# EAGLE design Hormiga_877_FTDI_Rev_C (EAGLE 9.6.2)

## Sheet 1 of 2: Main Board
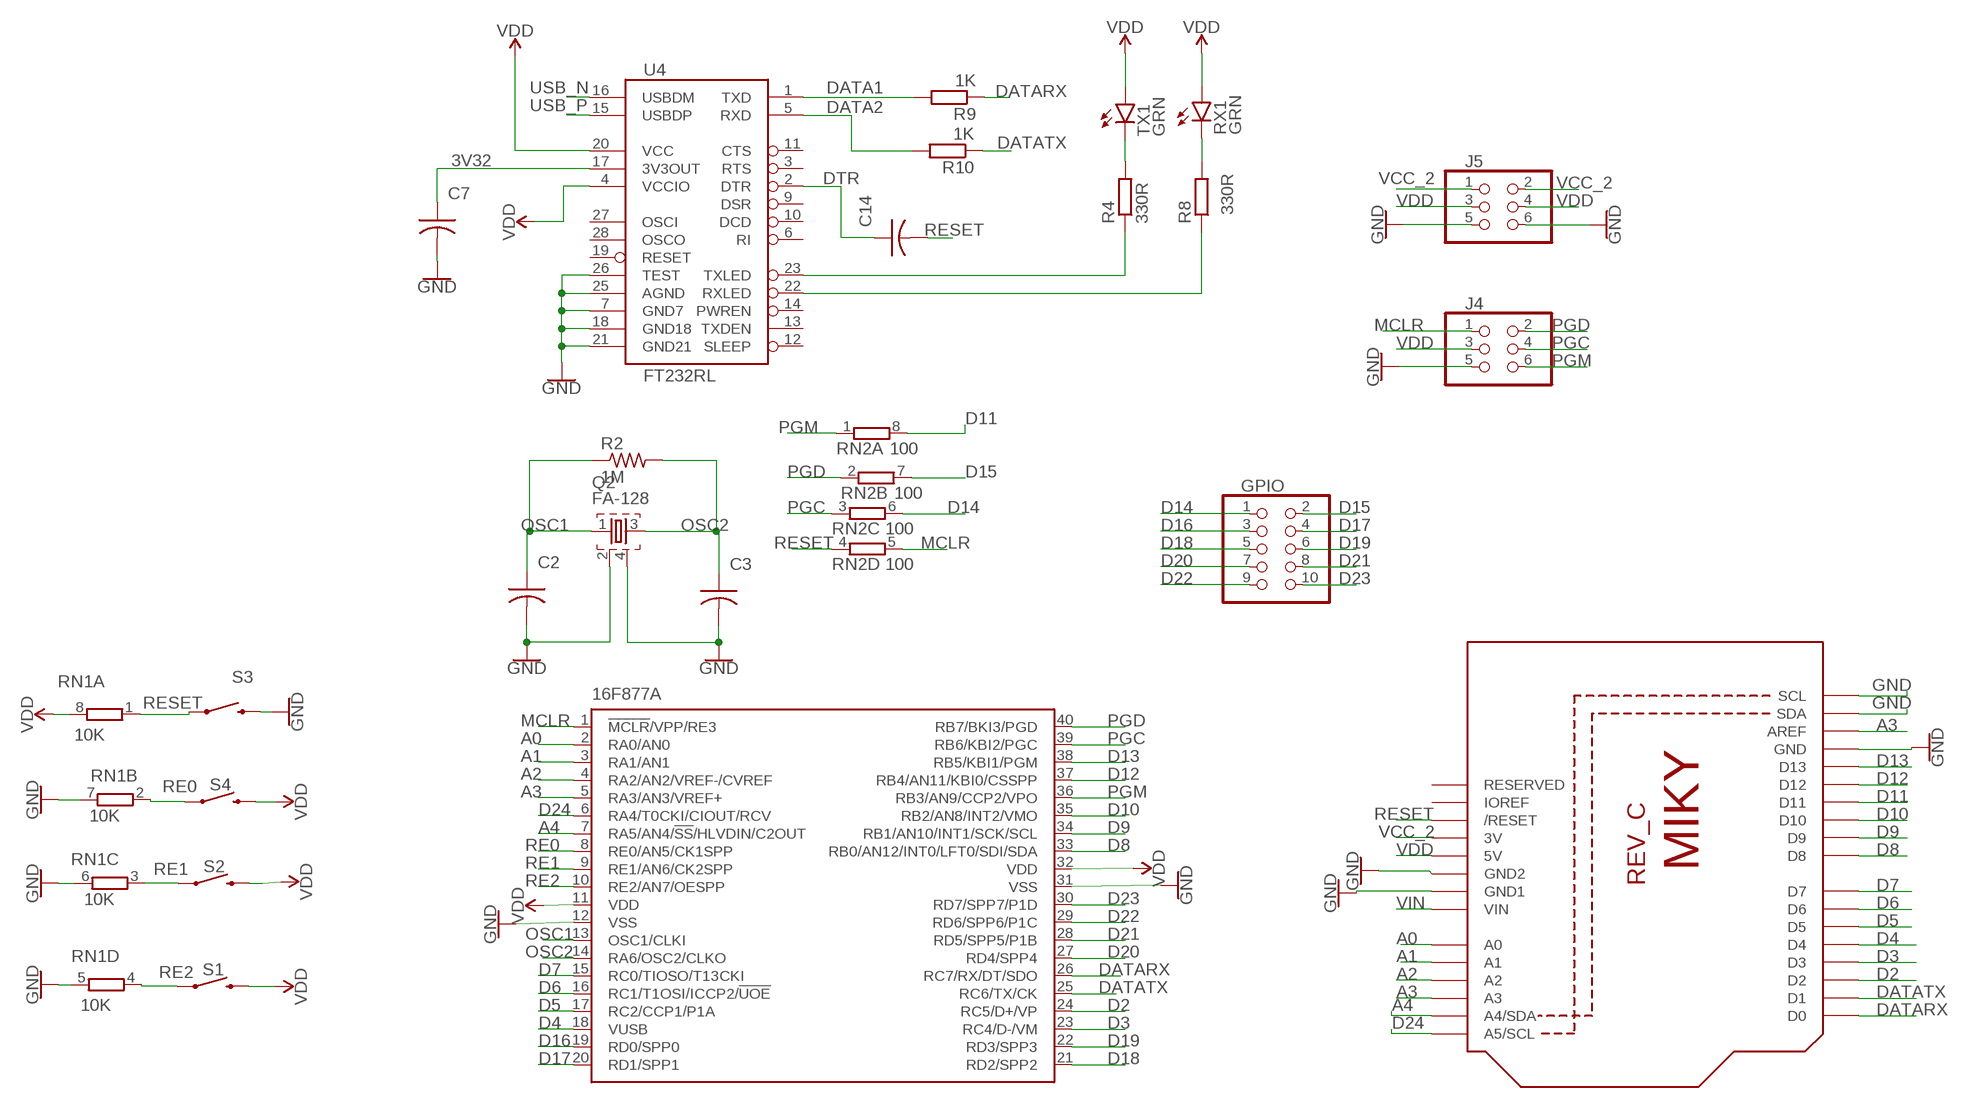
[diagram p0: schematic, sheet 1]

### Parts
16F877A  PIC18F4550_40  [DIL40]
C2  15pF  C-USC0603  [C0603]
C3  15pF  C-USC0603  [C0603]
C7  0.1uF  C-USC0603  [C0603]
C14  0.1uF  C-USC0603  [C0603]
GPIO  PINHD-2X5  [2X05]
J4  ICSP  PINHD-2X3  [2X03]
J5  POWER  PINHD-2X3  [2X03]
Q2  FA-128  [FA-128]
R2  1M  R-US_R0603  [R0603]
R4  330R  R-EU_R0805  [R0805]
R8  330R  R-EU_R0805  [R0805]
R9  1K  R-EU_R0805  [R0805]
R10  1K  R-EU_R0805  [R0805]
RN1  10K  4R-N0603-ARC  [0603-ARC]
RN2  100  4R-N0603-ARC  [0603-ARC]
RX1  GRN  LEDCHIP-LED0603  [CHIP-LED0603]
S1  MOMENTARY-SWITCH-SPST-SMD-5.2-REDUNDANT  [TACTILE_SWITCH_SMD_5.2MM]
S2  MOMENTARY-SWITCH-SPST-SMD-5.2-REDUNDANT  [TACTILE_SWITCH_SMD_5.2MM]
S3  MOMENTARY-SWITCH-SPST-SMD-5.2-REDUNDANT  [TACTILE_SWITCH_SMD_5.2MM]
S4  MOMENTARY-SWITCH-SPST-SMD-5.2-REDUNDANT  [TACTILE_SWITCH_SMD_5.2MM]
TX1  GRN  LEDCHIP-LED0603  [CHIP-LED0603]
U2  ARDUINOR3-DIMENSION  [ARDUINOR3]
U4  FT232RL  FT232RLSSOP  [SSOP28DB]

### Nets
3V32: C7.1 U4.17(3V3OUT)
A0 [SIGNALPIC]: 16F877A.2(RA0/AN0) U2.A0
A1: 16F877A.3(RA1/AN1) U2.A1
A2 [SIGNALPIC]: 16F877A.4(RA2/AN2/VREF-/CVREF) U2.A2
A3 [SIGNALPIC]: 16F877A.5(RA3/AN3/VREF+) U2.A3 U2.AREF
A4: 16F877A.7(RA5/AN4/!SS!/HLVDIN/C2OUT) U2.A4(A4/SDA)
D2 [SIGNALPIC]: 16F877A.24(RC5/D+/VP) U2.D2
D3 [SIGNALPIC]: 16F877A.23(RC4/D-/VM) U2.D3
D4 [SIGNALPIC]: 16F877A.18(VUSB) U2.D4
D5 [SIGNALPIC]: 16F877A.17(RC2/CCP1/P1A) U2.D5
D6 [SIGNALPIC]: 16F877A.16(RC1/T1OSI/ICCP2/!UOE) U2.D6
D7 [SIGNALPIC]: 16F877A.15(RC0/TIOSO/T13CKI) U2.D7
D8 [SIGNALPIC]: 16F877A.33(RB0/AN12/INT0/LFT0/SDI/SDA) U2.D8
D9 [SIGNALPIC]: 16F877A.34(RB1/AN10/INT1/SCK/SCL) U2.D9
D10 [SIGNALPIC]: 16F877A.35(RB2/AN8/INT2/VMO) U2.D10
D11 [SIGNALPIC]: RN2.8 U2.D11
D12 [SIGNALPIC]: 16F877A.37(RB4/AN11/KBI0/CSSPP) U2.D12
D13 [SIGNALPIC]: 16F877A.38(RB5/KBI1/PGM) U2.D13 ; also sheet 2
D14: GPIO.1 RN2.6
D15 [SIGNALPIC]: GPIO.2 RN2.7
D16 [SIGNALPIC]: 16F877A.19(RD0/SPP0) GPIO.3
D17 [SIGNALPIC]: 16F877A.20(RD1/SPP1) GPIO.4
D18 [SIGNALPIC]: 16F877A.21(RD2/SPP2) GPIO.5
D19 [SIGNALPIC]: 16F877A.22(RD3/SPP3) GPIO.6
D20 [SIGNALPIC]: 16F877A.27(RD4/SPP4) GPIO.7
D21 [SIGNALPIC]: 16F877A.28(RD5/SPP5/P1B) GPIO.8
D22 [SIGNALPIC]: 16F877A.29(RD6/SPP6/P1C) GPIO.9
D23: 16F877A.30(RD7/SPP7/P1D) GPIO.10
D24: 16F877A.6(RA4/T0CKI/CIOUT/RCV) U2.A5(A5/SCL)
DATA1: R9.2 U4.1(TXD)
DATA2: R10.2 U4.5(RXD)
DATARX [SIGNALPIC]: 16F877A.26(RC7/RX/DT/SDO) R9.1 U2.D0
DATATX [SIGNALPIC]: 16F877A.25(RC6/TX/CK) R10.1 U2.D1
DTR: C14.1 U4.2(DTR)
GND [SIGNALPIC]: 16F877A.12(VSS) 16F877A.31(VSS) C2.2 C3.2 C7.2 J4.5 J5.5 J5.6 Q2.2 Q2.4 RN1.5 RN1.6 RN1.7 S3.3 S3.4 U2.GND U2.GND1 U2.GND2 U2.SCL U2.SDA U4.7(GND7) U4.18(GND18) U4.21(GND21) U4.25(AGND) U4.26(TEST) ; also sheet 2
MCLR: 16F877A.1(!MCLR!/VPP/RE3) J4.1 RN2.5
OSC1 [SIGNAL3V3]: 16F877A.13(OSC1/CLKI) C2.1 Q2.1 R2.1
OSC2 [SIGNAL3V3]: 16F877A.14(RA6/OSC2/CLKO) C3.1 Q2.3 R2.2
PGC: 16F877A.39(RB6/KBI2/PGC) J4.4 RN2.3
PGD: 16F877A.40(RB7/BKI3/PGD) J4.2 RN2.2
PGM: 16F877A.36(RB3/AN9/CCP2/VPO) J4.6 RN2.1
RE0 [SIGNALPIC]: 16F877A.8(RE0/AN5/CK1SPP) RN1.2 S4.1 S4.2
RE1 [SIGNALPIC]: 16F877A.9(RE1/AN6/CK2SPP) RN1.3 S2.1 S2.2
RE2: 16F877A.10(RE2/AN7/OESPP) RN1.4 S1.1 S1.2
RESET [SIGNALPIC]: C14.2 RN1.1 RN2.4 S3.1 S3.2 U2.RESET(/RESET)
RX1: R8.2 RX1.C
RXLED [LEDUSART]: R8.1 U4.22(RXLED)
TX1: R4.2 TX1.C
TXLED [LEDUSART]: R4.1 U4.23(TXLED)
USB_N: U4.16(USBDM) ; also sheet 2
USB_P: U4.15(USBDP) ; also sheet 2
VCC_2 [SIGNAL3V3]: J5.1 J5.2 U2.3V ; also sheet 2
VDD: 16F877A.11(VDD) 16F877A.32(VDD) J4.3 J5.3 J5.4 RN1.8 RX1.A S1.3 S1.4 S2.3 S2.4 S4.3 S4.4 TX1.A U2.5V U4.4(VCCIO) U4.20(VCC) ; also sheet 2
VIN [SIGNALPIC]: U2.VIN ; also sheet 2
Unconnected: U2.IOREF U2.RESERVED U4.3(RTS) U4.6(RI) U4.9(DSR) U4.10(DCD) U4.11(CTS) U4.12(SLEEP) U4.13(TXDEN) U4.14(PWREN) U4.19(RESET) U4.27(OSCI) U4.28(OSCO)

## Sheet 2 of 2: Power_Supply
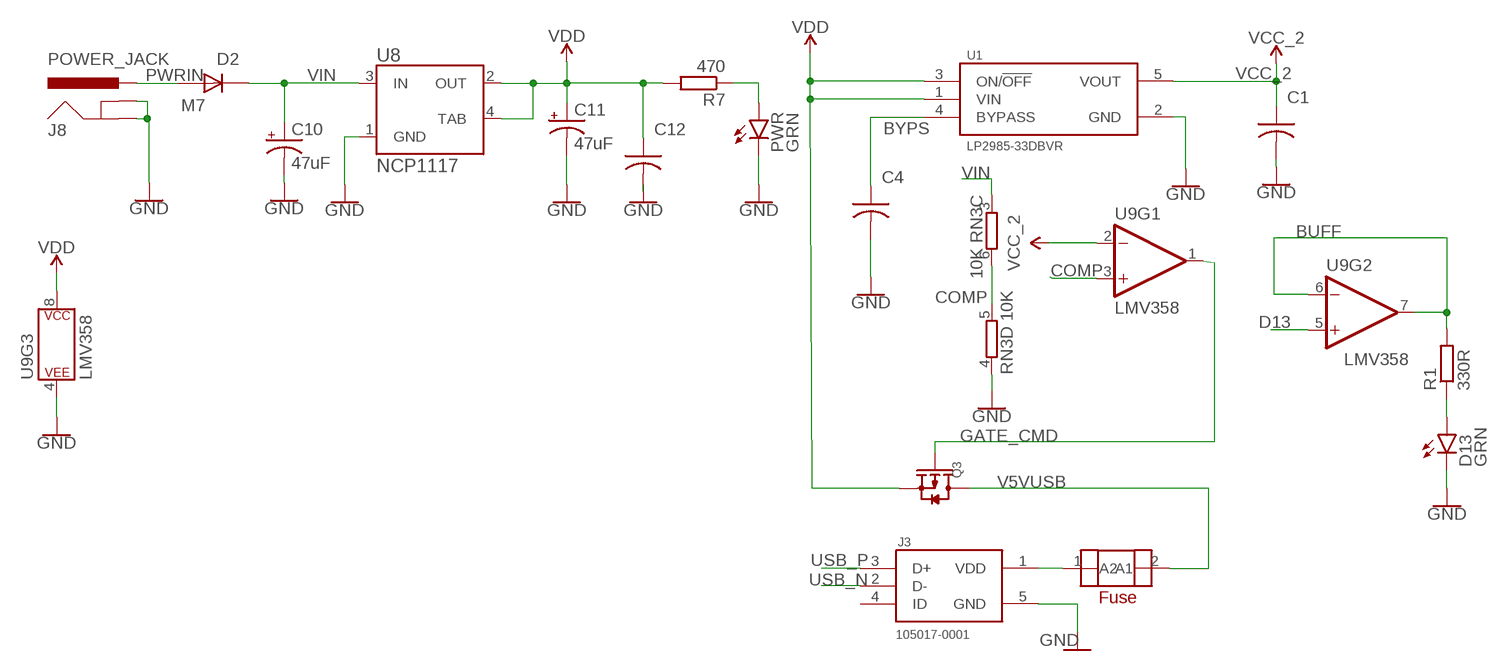
[diagram p1: schematic, sheet 2]

### Parts
C1  1.0uF  C-USC0603  [C0603]
C4  10nF  C-USC0603  [C0603]
C10  47uF  47UF-POLAR-PANASONIC_D-35V-20%  [PANASONIC_D]
C11  47uF  47UF-POLAR-PANASONIC_D-35V-20%  [PANASONIC_D]
C12  0.1uF  C-USC0603  [C0603]
D2  M7  [DIOM505270X240]
D13  GRN  LEDCHIP-LED0603  [CHIP-LED0603]
FUSE  FUSE0603  [R0603]
J3  105017-0001  [MOLEX_105017-0001]
J8  POWER_JACK  [POWER_JACK_PTH]
PWR  GRN  LEDCHIP-LED0603  [CHIP-LED0603]
Q3  SMD-MOSFET-P-CH-20V-2A(SOT-23)  [SOT-23]
R1  330R  R-EU_R0805  [R0805]
R7  470  R-EU_R0805  [R0805]
RN3  10K  4R-N0603-ARC  [0603-ARC]
U1  LP2985-33DBVR  [SOT95P280X145-5N]
U8  NCP1117  [SOT223]
U9  LMV358  LMV358SOIC  [SO08]

### Nets
BUFF [SIGNALPIC]: R1.2 U9.6(-IN) U9.7(OUT)
BYPS: C4.1 U1.4(BYPASS)
COMP: RN3.5 RN3.6 U9.3(+IN)
D13 [SIGNALPIC]: U9.5(+IN) ; also sheet 1
D13LED [SIGNALPIC]: D13.A R1.1
GATE_CMD [SIGNAL]: Q3.1(G) U9.1(OUT)
GND [SIGNALPIC]: C1.2 C4.2 C10.- C11.- C12.2 D13.C J3.5(GND) J8.GND J8.GNDBREAK PWR.C RN3.4 U1.2(GND) U8.1(GND) U9.4(P$V-) ; also sheet 1
PWRIN [SIGNALPIC]: D2.A J8.PWR
PWRLED [SIGNALPIC]: PWR.A R7.1
USB_N: J3.2(D-) ; also sheet 1
USB_P: J3.3(D+) ; also sheet 1
V5VUSB: FUSE.2(A2) Q3.3(D)
VCC_2 [SIGNAL3V3]: C1.1 U1.5(VOUT) U9.2(-IN) ; also sheet 1
VDD: C11.+ C12.1 Q3.2(S) R7.2 U1.1(VIN) U1.3(ON/!OFF) U8.2(OUT) U8.4(TAB) U9.8(P$V+) ; also sheet 1
VDD5: FUSE.1(A1) J3.1(VDD)
VIN [SIGNALPIC]: C10.+ D2.C RN3.3 U8.3(IN) ; also sheet 1
Unconnected: J3.4(ID) RN3.1 RN3.2 RN3.7 RN3.8

## Library data of the parts
16F877A = microchip:PIC18F4*_40: USB Microcontrollers with nanoWatt Technology High-Performance, Enhanced Flash, 28/40/44-Pin, Source: http://ww1.microchip.com/downloads/en/devicedoc/39632c.pdf; MF: MICROCHIP; MPN: PIC18F4550-I/P; OC_FARNELL: 9321357; OC_NEWARK: 74K8623
C1 = rcl:C-US: CAPACITOR, American symbol; MPN: C1608X5R1E105K080AC; OC_NEWARK: 90R7677; SPICEPREFIX: C
C2 C3 = rcl:C-US: CAPACITOR, American symbol; MF: FARNELL; MPN: CC0402JRNPO9BN150; OC_NEWARK: 69C9582; SPICEPREFIX: C
C4 = rcl:C-US: CAPACITOR, American symbol; MPN: C0603C103K1RACTU; OC_NEWARK: 29T8974; SPICEPREFIX: C
C7 C12 C14 = rcl:C-US: CAPACITOR, American symbol; MPN: C0603C103J1RACTU; OC_NEWARK: 07X0751; SPICEPREFIX: C
C10 C11 = SparkFun-Capacitors:47UF-POLAR: 47µF polarized capacitors A capacitor is a passive two-terminal electrical component used to store electrical energy temporarily in an electric field.; MPN: EEE-1CA470WR; OC_NEWARK: 53W3779; PROD_ID: CAP-08478
D2 = Tonche_Library:M7: none; AVAILABILITY: Unavailable; MP: M7; MPN: RFN1LAM7STFTR; OC_NEWARK: 58AC3694; PACKAGE: DO-214 Diodes Inc.; PRICE: 0.01 USD
D13 PWR RX1 TX1 = led:LED: LED OSRAM: - CHIPLED LG R971, LG N971, LY N971, LG Q971, LY Q971, LO R971, LY R971 LH N974, LH R974 LS Q976, LO Q976, LY Q976 LO Q996 - Hyper CHIPLED LW Q18S LB Q993, LB Q99A, LB R99A - SideLED LS A670, LO A670, LY A670, LG A670, LP A670 LB A673, LV A673, LT A673, LW A673 LH A674 LY A675 LS A676, LA A676, LO A676, LY A676, LW A676 LS A679, LY A679, LG A679 - Hyper Micro SIDELED® LS Y876, LA Y876, LO Y876, LY Y876 LT Y87S - SmartLED LW L88C, LW L88S LB L89C, LB L89S, LG L890 LS L89K, LO L89K, LY L89K LS L896, LA L896, LO L896, LY L896 - TOPLED LS T670, LO T670, LY T670, LG T670, LP T670 LSG T670, LSP T670, LSY T670, LOP T670, LYG T670 LG T671, LOG T671, LSG T671 LB T673, LV T673, LT T673, LW T673 LH T674 LS T676, LA T676, LO T676, LY T676, LB T676, LH T676, LSB T676, LW T676 LB T67C, LV T67C, LT T67C, LS T67K, LO T67K, LY T67K, LW E67C LS E67B, LA E67B, LO E67B, LY E67B, LB E67C, LV E67C, LT E67C LW T67C LS T679, LY T679, LG T679 LS T770, LO T770, LY T770, LG T770, LP T770 LB T773, LV T773, LT T773, LW T773 LH T774 LS E675, LA E675, LY E675, LS T675 LS T776, LA T776, LO T776, LY T776, LB T776 LHGB T686 LT T68C, LB T68C - Hyper Mini TOPLED® LB M676 - Mini TOPLED Santana® LG M470 LS M47K, LO M47K, LY M47K Source: http://www.osram.convergy.de LUXEON: - LUMILED® LXK2-PW12-R00, LXK2-PW12-S00, LXK2-PW14-U00, LXK2-PW14-V00 LXK2-PM12-R00, LXK2-PM12-S00, LXK2-PM14-U00 LXK2-PE12-Q00, LXK2-PE12-R00, LXK2-PE12-S00, LXK2-PE14-T00, LXK2-PE14-U00 LXK2-PB12-K00, LXK2-PB12-L00, LXK2-PB12-M00, LXK2-PB14-N00, LXK2-PB14-P00, LXK2-PB14-Q00 LXK2-PR12-L00, LXK2-PR12-M00, LXK2-PR14-Q00, LXK2-PR14-R00 LXK2-PD12-Q00, LXK2-PD12-R00, LXK2-PD12-S00 LXK2-PH12-R00, LXK2-PH12-S00 LXK2-PL12-P00, LXK2-PL12-Q00, LXK2-PL12-R00 Source: www.luxeon.com KINGBRIGHT: KA-3528ASYC Source: www.kingbright.com; MPN: HSME-C191; OC_NEWARK: 05M0345
FUSE = Tonche_Library:FUSE0603
GPIO = pinhead:PINHD-2X5: PIN HEADER
J3 = MICRO-B_MOLEX_105017-0001:105017-0001; AVAILABILITY: Unavailable; DESCRIPTION: Conn USB Type B M 5 POS 0.65mm Solder RA Thru-Hole 5 Terminal 1 Port Embossed T/R; MF: Molex; MP: 105017-0001; PACKAGE: None; PRICE: None
J4 J5 = pinhead:PINHD-2X3: PIN HEADER
J8 = SparkFun-Connectors:POWER_JACK: Power Jack Connector This is the standard 5.5mm barrel jack for power. The PTH is the most common, proven, reliable, footprint. The Slot footprint only works if the mill layer is transmitted to the PCB fab house so be warned. Here are the connectors we sell at SparkFun: DC Barrel Power Jack/Connector <https://www.sparkfun.com/products/119> (PRT-00119) DC Barrel Power Jack/Connector (SMD) <https://www.sparkfun.com/products/12748> (PRT-12748) DC Barrel Jack Adapter - Breadboard Compatible <https://www.sparkfun.com/products/10811> (PRT-10811) It is used on this SparkFun product (and many, many others): SparkFun RedBoard - Programmed with Arduino <https://www.sparkfun.com/products/12757> (DEV-12757) Also, if you need a mating power supply or connector, please check these out: Wall Adapter Power Supply - 9VDC 650mA <https://www.sparkfun.com/products/298> (TOL-00298) DC Barrel Jack Adapter - Male <https://www.sparkfun.com/products/10287> (PRT-10287); MPN: FC681465P; OC_NEWARK: 20T2054; PROD_ID: CONN-08197
Q2 = crystal:FA-: MHz RANGE CRYSTAL UNIT Source: Epson Toyocom
Q3 = SMD-MOSFET-P-CH-20V-2A_SOT-23_:SMD-MOSFET-P-CH-20V-2A(SOT-23): 305030026; AVAILABILITY: Good; DESCRIPTION: Single P-Channel 20V 70 mOhm Logic Level PowerTrench Mosfet SSOT-3; MF: FAIRCHILD SEMICONDUCTOR; MP: FDN340P; MPN: FDN340P; OC_NEWARK: 58K8841; PACKAGE: SC-59 ON Semiconductor; PRICE: 0.19 USD
R1 R4 R8 = rcl:R-EU_: RESISTOR, European symbol; MPN: ERJ-6GEYJ331V; OC_NEWARK: 65T8817; SPICEPREFIX: R
R2 = rcl:R-US_: RESISTOR, American symbol; SPICEPREFIX: R
R7 = rcl:R-EU_: RESISTOR, European symbol; MPN: ERJ-6GEYJ471V; OC_NEWARK: 65T8826; SPICEPREFIX: R
R9 R10 = rcl:R-EU_: RESISTOR, European symbol; MPN: EXB-V8V103JV; OC_NEWARK: 65T8998; SPICEPREFIX: R
RN1 RN3 = resistor-dil:4R-N: Array Chip Resistor Source: RS Component / Phycomp; MPN: EXB-V8V103JV; OC_FARNELL: unknown; OC_NEWARK: 65T8998
RN2 = resistor-dil:4R-N: Array Chip Resistor Source: RS Component / Phycomp; OC_FARNELL: unknown; OC_NEWARK: unknown
S1-S4 = SparkFun-Switches:MOMENTARY-SWITCH-SPST: Momentary Switch (Pushbutton) - SPST Normally-open (NO) SPST momentary switches (buttons, pushbuttons). Variants PTH-12MM - 12mm square, through-hole Momentary Pushbutton Switch - 12mm Square <https://www.sparkfun.com/products/9190> (COM-09190) PTH-6.0MM, PTH-6.0MM-KIT - 6.0mm square, through-hole Mini Pushbutton Switch <https://www.sparkfun.com/products/97> (COM-00097) KIT package intended for soldering kit's - only one side of pads' copper is exposed. PTH-RIGHT-ANGLE-KIT - Right-angle, through-hole Right Angle Tactile Button <https://www.sparkfun.com/products/10791> - Used on SparkFun BigTime Watch Kit <https://www.sparkfun.com/products/11734> SMD-12MM - 12mm square, surface-mount Tactile Button - SMD (12mm) <https://www.sparkfun.com/products/12993> (COM-12993) Used on SparkFun PicoBoard <https://www.sparkfun.com/products/11888> SMD-4.5MM - 4.5mm Square Trackball Switch Used on SparkFun Blackberry Trackballer Breakout <https://www.sparkfun.com/products/13169> SMD-4.6MMX2.8MM - 4.60mm x 2.80mm, surface mount Used on SparkFun SAMD21 Mini Breakout <https://www.sparkfun.com/products/13664> SMD-5.2MM, SMD-5.2-REDUNDANT - 5.2mm square, surface-mount Mini Pushbutton Switch - SMD <https://www.sparkfun.com/products/8720> (COM-08720) Used on Arduino Pro Mini <https://www.sparkfun.com/products/11114> REDUNDANT package connects both switch circuits together SMD-6.0X3.5MM - 6.0 x 3.5mm, surface mount Momentary Reset Switch SMD <https://www.sparkfun.com/products/8229> (COM-08229) SMD-6.2MM-TALL - 6.2mm square, surface mount Tactile Button - SMD (6mm) <https://www.sparkfun.com/products/12992> Used on SparkFun Digital Sandbox <https://www.sparkfun.com/products/12651> SMD-RIGHT-ANGLE - Right-angle, surface mount Used on SparkFun Block for Intel® Edison - Arduino <https://www.sparkfun.com/products/13036>; MPN: TL3301AF160QG; OC_NEWARK: 15N4497; PROD_ID: SWCH-08247; SF_SKU: COM-08720
U1 = LP2985-33DBVR:LP2985-33DBVR: LP2985 150-mA Low-noise Low-dropout Regulator With Shutdown; AVAILABILITY: Good; DESCRIPTION: Single Output LDO, 150mA, Fixed_3.3V_, 1.5% Tolerance, Low Quiescent Current, Low Noise 5-SOT-23 -40 to 125; MF: TEXAS INSTRUMENTS; MP: LP2985-33DBVR; MPN: LP2985-33DBVR; OC_NEWARK: 43J9346; PACKAGE: SOT-23-5 Texas Instruments; PRICE: 0.39 USD
U2 = Placa_Arduino_Compatible:ARDUINOR3: This is a new object for the new Arduino R3 - with extra pins that you may want to use (such as IOref, and duplicated A4/A5
U4 = SparkFun-IC-Comms:FT232RL: FT232RL USB UART FT232RL 4th Generation USB UART (USB <-> Serial) Controller. Datasheet <http://www.sparkfun.com/datasheets/IC/FT232R_v104.pdf> SparkFun Products Component <https://www.sparkfun.com/products/650> (COM-00650) SparkFun RedBot Mainboard <https://www.sparkfun.com/products/12097> (ROB-12097) SparkFun FTDI Basic Breakout - 5V <https://www.sparkfun.com/products/9716> (DEV-09716) SparkFun FTDI Basic Breakout - 3.3V <https://www.sparkfun.com/products/9873> (DEV-09873) Bus Pirate - v3.6a <https://www.sparkfun.com/products/12942> (TOL-12942) SparkFun USB to Serial Breakout - FT232RL <https://www.sparkfun.com/products/12731> (BOB-12731) SparkFun PicoBoard <https://www.sparkfun.com/products/11888> (WIG-11888) SparkFun RFID USB Reader <https://www.sparkfun.com/products/9963> (SEN-09963) LilyPad FTDI Basic Breakout - 5V <https://www.sparkfun.com/products/10275> (DEV-10275) SparkFun Stepoko <https://www.sparkfun.com/products/13899> (ROB-13899); MPN: FT232RL-REEL; OC_NEWARK: 91K9918; PROD_ID: IC-00870
U8 = NCP1117:NCP1117: Check availability <https://pricing.snapeda.com/parts/NCP1117/ON%20Semiconductor/view-part?ref=eda>; AVAILABILITY: In Stock; DESCRIPTION: Linear Voltage Regulator IC Positive Fixed 1 Output 1A SOT-223; MF: ON SEMICONDUCTOR; MP: NCP1117; MPN: NCP1117ST50T3G; OC_NEWARK: 71J6563; PACKAGE: None; PRICE: None
U9 = SparkFun-IC-Amplifiers:LMV358: IC LMV358 DUAL OP AMP Jellybean rail-to-rail output op-amp SparkFun Products SparkFun PicoBoard <https://www.sparkfun.com/products/11888> (WIG-11888) SparkFun Vernier Interface Shield <https://www.sparkfun.com/products/12858> (DEV-12858) SparkFun Blynk Board - ESP8266 <https://www.sparkfun.com/products/13794> (WRL-13794) SparkFun Digital Sandbox <https://www.sparkfun.com/products/12651> (DEV-12651 RoHS); MF: FAIRCHILD SEMICONDUCTOR; MPN: LMV358AM8X; OC_NEWARK: 29H0537; PROD_ID: IC-09657

## Net classes
0 LOGIC: width 0.127 mm, clearance 0.254 mm
1 SIGNAL: width 0.305 mm, clearance 0.102 mm
2 3V3: width 0.305 mm, clearance 0.102 mm
3 SIGNALPIC: width 0.127 mm, clearance 0.102 mm
4 SIGNAL3V3: width 0.305 mm, clearance 0.127 mm
5 LEDUSART: width 0.305 mm, clearance 0.127 mm

## Board
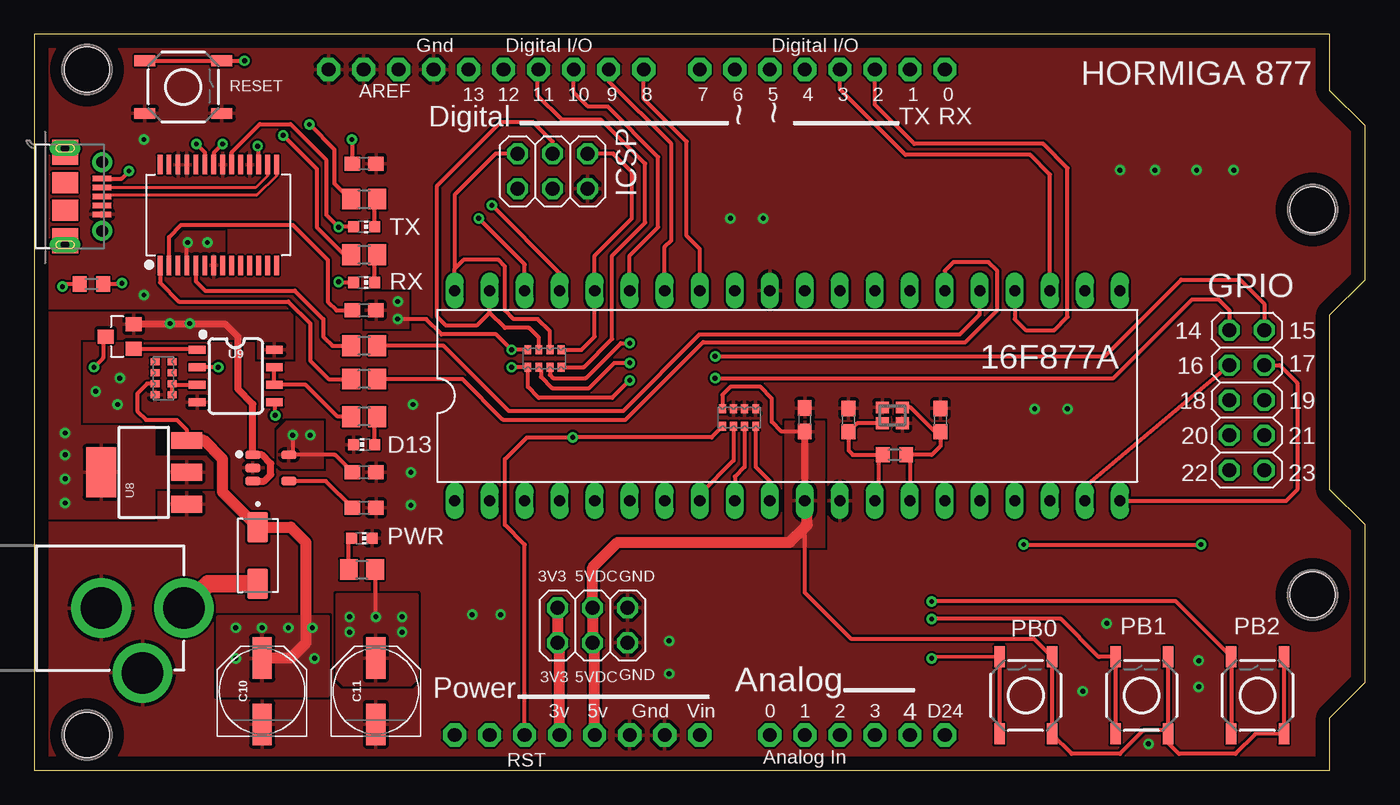
[diagram p2: board, top side]
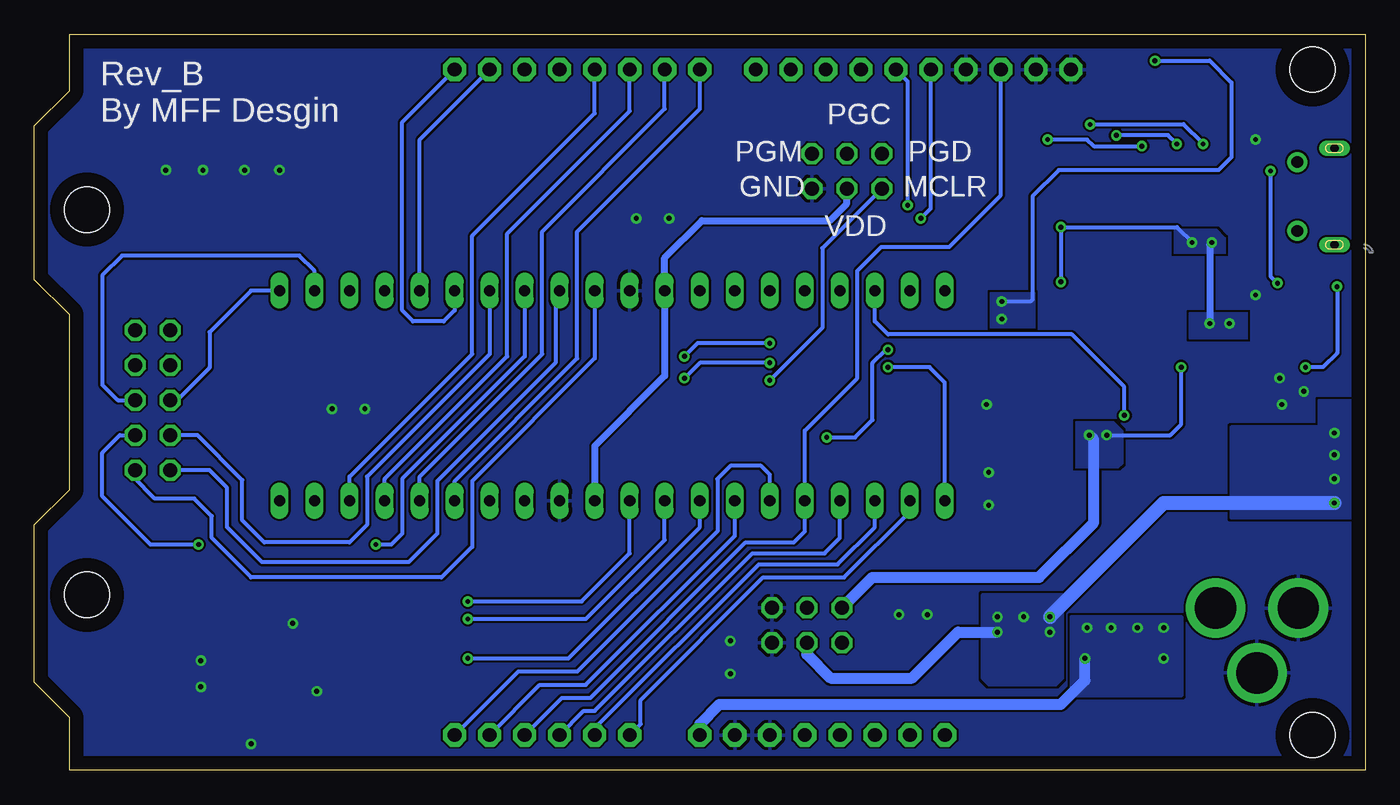
[diagram p3: board, bottom side, seen from below]

Size 96.52 x 53.34 mm. Coordinates in mm from the lower left corner, seen from the top.
Copper layers (1*16): Top 0.035mm / dielectric 1.5mm / Bottom 0.035mm
Design rules "default": minimum track width 6mil, minimum drill 0.35mm, track to track 6mil, track to pad 6mil, pad to pad 6mil, via to via 6mil, smd to smd 6mil, copper to edge 40mil, drill to drill 6mil, minimum pad ring 10mil, minimum via ring 8mil, stop-mask expansion 4mil, vias tented up to drill 0mil, thermal gap 10mil

### Footprints (pad centres in the part's own frame; a part is rotated, then mirrored left to right if it is on the bottom)
DIL40 = drill 0.813 long: 1 -24.13,-7.62; 2 -21.59,-7.62; 3 -19.05,-7.62; 4 -16.51,-7.62; 5 -13.97,-7.62; 6 -11.43,-7.62; 7 -8.89,-7.62; 8 -6.35,-7.62; 9 -3.81,-7.62; 10 -1.27,-7.62; 11 1.27,-7.62; 12 3.81,-7.62; 13 6.35,-7.62; 14 8.89,-7.62; 15 11.43,-7.62; 16 13.97,-7.62; 17 16.51,-7.62; 18 19.05,-7.62; 19 21.59,-7.62; 20 24.13,-7.62; 21 24.13,7.62; 22 21.59,7.62; 23 19.05,7.62; 24 16.51,7.62; 25 13.97,7.62; 26 11.43,7.62; 27 8.89,7.62; 28 6.35,7.62; 29 3.81,7.62; 30 1.27,7.62; 31 -1.27,7.62; 32 -3.81,7.62; 33 -6.35,7.62; 34 -8.89,7.62; 35 -11.43,7.62; 36 -13.97,7.62; 37 -16.51,7.62; 38 -19.05,7.62; 39 -21.59,7.62; 40 -24.13,7.62
C0603 = smd 1.1 x 1: 1 -0.85,0; 2 0.85,0
PANASONIC_D = smd 3 x 1.4: + 2.4,0; - -2.4,0
DIOM505270X240 = smd 2.21 x 1.53: A 2.05,0; C -2.05,0
CHIP-LED0603 = smd 0.8 x 0.8: A 0,-0.75; C 0,0.75
R0603 = smd 1 x 1.1: 1 -0.85,0; 2 0.85,0
2X05 = drill 1.016 octagon: 1 -5.08,-1.27; 2 -5.08,1.27; 3 -2.54,-1.27; 4 -2.54,1.27; 5 0,-1.27; 6 0,1.27; 7 2.54,-1.27; 8 2.54,1.27; 9 5.08,-1.27; 10 5.08,1.27
MOLEX_105017-0001 = smd 0.4 x 1.35: 1 -1.3,2.675; 2 -0.65,2.675; 3 0,2.675; 4 0.65,2.675; 5 1.3,2.675 | drill 0.85 pad 1.45: P$1 -2.5,2.7; P$2 2.5,2.7 | smd 1.5 x 1.9: P$8 -1,0; P$9 1,0 | smd 1.8 x 1.9: P$10 -3.2,0; P$11 3.2,0 | drill 0.6 pad 0.8 long: P$12 -3.5,0; P$13 3.5,0
2X03 = drill 1.016 octagon: 1 -2.54,-1.27; 2 -2.54,1.27; 3 0,-1.27; 4 0,1.27; 5 2.54,-1.27; 6 2.54,1.27
POWER_JACK_PTH = drill 2.997 pad 4.318: GND 0,7.7; GNDBREAK 4.7,10.7; PWR 0,13.7
FA-128 = smd 0.95 x 0.85: 1 -0.725,-0.575; 2 0.725,-0.575; 3 0.725,0.575; 4 -0.725,0.575
SOT-23 = smd 1.016 x 1.143: 1 -0.889,-1.016; 2 0.889,-1.016; 3 0,1.016
R0805 = smd 1.3 x 1.5: 1 -0.95,0; 2 0.95,0
0603-ARC = smd 0.5 x 0.65: 1 -1.2,-0.625; 2 -0.4,-0.625; 3 0.4,-0.625; 4 1.2,-0.625; 5 1.2,0.625; 6 0.4,0.625; 7 -0.4,0.625; 8 -1.2,0.625
TACTILE_SWITCH_SMD_5.2MM = smd 1.524 x 0.762: 1 -2.794,1.905; 2 2.794,1.905; 3 -2.794,-1.905; 4 2.794,-1.905
SOT95P280X145-5N = smd 1.1 x 0.6: 1 -1.3,0.95; 2 -1.3,0; 3 -1.3,-0.95; 4 1.3,-0.95; 5 1.3,0.95
ARDUINOR3 = drill 1 pad 1.676 octagon: 3V 38.1,2.54; 5V 40.64,2.54; A0 53.34,2.54; A1 55.88,2.54; A2 58.42,2.54; A3 60.96,2.54; A4 63.5,2.54; A5 66.04,2.54; AREF 26.416,50.8; D0 66.04,50.8; D1 63.5,50.8; D2 60.96,50.8; D3 58.42,50.8; D4 55.88,50.8; D5 53.34,50.8; D6 50.8,50.8; D7 48.26,50.8; D8 44.196,50.8; D9 41.656,50.8; D10 39.116,50.8; D11 36.576,50.8; D12 34.036,50.8; D13 31.496,50.8; GND 28.956,50.8; GND1 45.72,2.54; GND2 43.18,2.54; IOREF 33.02,2.54; RESERVED 30.48,2.54; RESET 35.56,2.54; SCL 21.336,50.8; SDA 23.876,50.8; VIN 48.26,2.54 | hole 3.302: 3.81,50.8; 3.81,2.54; 92.71,12.7; 92.71,40.64
SSOP28DB = smd 0.348 x 1.397: 1 -4.225,-3.656; 2 -3.575,-3.656; 3 -2.925,-3.656; 4 -2.275,-3.656; 5 -1.625,-3.656; 6 -0.975,-3.656; 7 -0.325,-3.656; 8 0.325,-3.656; 9 0.975,-3.656; 10 1.625,-3.656; 11 2.275,-3.656; 12 2.925,-3.656; 13 3.575,-3.656; 14 4.225,-3.656; 15 4.225,3.656; 16 3.575,3.656; 17 2.925,3.656; 18 2.275,3.656; 19 1.625,3.656; 20 0.975,3.656; 21 0.325,3.656; 22 -0.325,3.656; 23 -0.975,3.656; 24 -1.625,3.656; 25 -2.275,3.656; 26 -2.925,3.656; 27 -3.575,3.656; 28 -4.225,3.656
SOT223 = smd 1.219 x 2.235: 1 -2.311,-3.099; 2 0,-3.099; 3 2.311,-3.099 | smd 3.6 x 2.2: 4 0,3.099
SO08 = smd 0.6 x 1.2: 1 -1.905,-2.8; 2 -0.635,-2.8; 3 0.635,-2.8; 4 1.905,-2.8; 5 1.905,2.8; 6 0.635,2.8; 7 -0.635,2.8; 8 -1.905,2.8

### Placement (x,y rotation side)
16F877A  54.61,27.15 0 top
C1  23.92,21.59 0 top
C2  59.05,25.37 90 top
C3  65.72,25.37 90 top
C4  23.92,19.02 0 top
C7  23.92,43.97 0 top
C10  16.51,5.71 90 top
C11  24.77,5.71 90 top
C12  55.88,25.4 90 top
C14  23.92,33.34 0 top
D2  16.19,15.56 270 top
D13  23.92,23.61 90 top
FUSE  4.13,35.24 180 top
GPIO  87.93,26.82 270 top
J3  2.22,41.59 270 top
J4  37.59,43.43 0 top
J5  40.49,10.49 0 top
J8  -2.86,11.75 270 top
PWR  23.76,16.81 270 top
Q2  62.23,25.72 0 top
Q3  6.19,31.43 90 top
R1  23.92,25.62 180 top
R2  62.39,22.86 0 top
R4  23.92,41.4 0 top
R7  23.76,14.54 0 top
R8  23.92,37.37 0 top
R9  23.92,28.35 180 top
R10  23.92,30.77 180 top
RN1  51.12,25.56 0 top
RN2  36.99,29.84 180 top
RN3  9.37,28.42 270 top
RX1  23.92,35.36 270 top
S1  88.72,5.41 90 top
S2  80.31,5.41 90 top
S3  10.79,49.53 0 top
S4  71.91,5.41 90 top
TX1  23.92,39.39 270 top
U1  17.14,21.91 0 top
U2  0,0 0 top
U4  13.34,40.25 0 top
U8  7.94,21.59 90 top
U9  14.61,28.57 270 top

### Tracks (layer width: path | path; a pad name or v marks a point on that pad's centre or on a via)
3V32  (via drill 0.35)
  Top 0.305: U4.17 16.26,45.18 v16.19,45.24 | C7.1 23.07,45.67 v23.02,45.72
  Bottom 0.305: v16.19,45.24 v16.2,45.24 19.68,45.24 20.16,45.72 v23.02,45.72
A0
  Bottom 0.305: U2.A0 52.55,3.33 52.55,5.08 43.66,13.97 37.78,13.97 33.02,18.73 16F877A.2
A1
  Bottom 0.305: U2.A1 55.88,3.02 43.97,14.92 38.26,14.92 35.56,17.62 16F877A.3
A2
  Bottom 0.305: U2.A2 56.67,4.29 55.88,4.29 44.45,15.72 39.21,15.72 38.1,16.83 16F877A.4
A3
  Bottom 0.305: U2.AREF 26.42,41.69 30.16,37.94 35.08,37.94 36.83,36.2 36.83,28.42 40.64,24.61 16F877A.5 40.64,17.3 41.43,16.51 44.93,16.51 56.2,5.24 58.26,5.24 U2.A3
A4
  Bottom 0.305: U2.A4 59.86,6.18 56.53,6.18 45.72,16.99 16F877A.7
BUFF
  Top 0.305: U9.7 U9.6 19.68,27.94 22,25.62 R1.2
BYPS
  Top 0.305: C4.1 21.13,20.96 U1.4
COMP
  Top 0.305: RN3.5 RN3.6 10.07,27.94 U9.3
D2
  Top 0.305: 16F877A.24 71.12,32.7 71.91,31.91 73.98,31.91 74.93,32.86 74.93,43.66 73.18,45.4 63.82,45.4 60.96,48.26 U2.D2
D3
  Top 0.305: 16F877A.23 73.66,43.18 72.23,44.61 63.18,44.61 58.42,49.37 U2.D3
D4
  Bottom 0.305: 16F877A.18 73.66,21.27 64.77,30.16 64.77,38.73 55.88,47.62 U2.D4
D5
  Bottom 0.305: 16F877A.17 71.12,21.11 62.23,30 62.23,38.89 53.34,47.78 U2.D5
D6
  Bottom 0.305: 16F877A.16 68.58,21.27 59.69,30.16 59.69,39.05 50.8,47.94 U2.D6
D7
  Bottom 0.305: 16F877A.15 66.04,20.95 57.15,29.84 57.15,39.05 48.26,47.94 U2.D7
D8
  Top 0.305: 16F877A.33 48.26,37.78 47.31,38.73 47.31,45.56 44.2,48.67 U2.D8
D9
  Top 0.305: 16F877A.34 45.72,37.94 46.2,38.42 46.2,45.4 41.66,49.94 U2.D9
D10
  Top 0.305: 16F877A.35 43.18,37.31 45.24,39.37 45.24,44.45 41.59,48.1 40.16,48.1 39.12,49.15 U2.D10
D11
  Top 0.305: RN2.8 39.86,29.22 41.91,31.27 41.91,37.31 44.29,39.69 44.29,43.97 41.12,47.15 38.26,47.15 36.51,48.9 36.51,50.74 U2.D11
D12  (via drill 0.35)
  Top 0.305: 16F877A.37 38.1,36.04 v33.18,40.96
  Bottom 0.305: v33.18,40.96 33.18,49.94 U2.D12
D13  (via drill 0.35)
  Top 0.305: v17.46,25.72 17.46,26.67 U9.5 | 16F877A.38 35.56,36.67 v32.23,40.01
  Bottom 0.305: v17.46,25.72 17.46,27.78 21.27,31.59 34.61,31.59 35.56,32.54 16F877A.38 | v32.23,40.01 31.5,40.73 U2.D13
D13LED
  Top 0.305: D13.A 24.67,25.42 R1.1
D14  (via drill 0.35)
  Top 0.305: RN2.6 36.73,29.08 36.73,28.52 37.55,27.7 40.24,27.7 42.07,29.53 v43.18,29.53 | v49.37,28.42 78.26,28.42 83.98,34.13 85.88,34.13 86.67,33.35 GPIO.1
  Bottom 0.305: v43.18,29.53 48.26,29.53 v49.37,28.42
D15  (via drill 0.35)
  Top 0.305: RN2.7 37.39,28.65 37.62,28.42 40.01,28.42 42.55,30.96 v43.18,30.96 | v49.37,30 77.63,30 83.19,35.56 87.47,35.56 89.2,33.83 GPIO.2
  Bottom 0.305: v43.18,30.96 48.42,30.96 v49.37,30
D16
  Top 0.305: 16F877A.19 76.2,20.55 GPIO.3
D17
  Top 0.305: 16F877A.20 90.81,19.53 91.6,20.32 91.6,28.08 90.32,29.36 GPIO.4
D18
  Bottom 0.305: 16F877A.21 80.8,34.77 83.82,31.75 83.82,29.18 86.18,26.82 GPIO.5
D19
  Bottom 0.305: 16F877A.22 76.2,36.2 77.31,37.31 90.17,37.31 91.6,35.88 91.6,27.94 90.48,26.82 GPIO.6
D20
  Bottom 0.305: 16F877A.27 63.5,30.16 72.39,21.27 72.39,17.78 73.66,16.51 79.85,16.51 81.44,18.1 81.44,21.02 84.7,24.28 GPIO.7
D21  (via drill 0.35)
  Top 0.305: v71.75,16.35 v84.61,16.35
  Bottom 0.305: 16F877A.28 60.96,30 69.85,21.11 69.85,17.14 70.64,16.35 v71.75,16.35 | v84.61,16.35 88.11,16.35 91.6,19.84 91.6,23 90.32,24.28 GPIO.8
D22
  Bottom 0.305: 16F877A.29 58.74,34.45 58.74,29.53 67.31,20.95 67.31,17.14 69.37,15.08 80.01,15.08 82.55,17.62 82.55,20.46 83.83,21.74 GPIO.9
D23
  Bottom 0.305: 16F877A.30 55.88,29.84 64.77,20.95 64.77,16.19 66.99,13.97 80.8,13.97 83.66,16.83 83.66,18.41 84.93,19.68 87.79,19.68 89.32,21.22 GPIO.10
D24
  Bottom 0.305: 16F877A.6 43.18,21.43 43.81,22.07 46.04,22.07 46.99,21.11 46.99,17.3 57.15,7.14 61.44,7.14 U2.A5
DATA1
  Top 0.305: U4.1 9.11,35.34 10.48,33.97 18.41,33.97 20,32.38 20,29.69 21.34,28.35 R9.2
DATA2
  Top 0.305: U4.5 11.71,35.44 12.38,34.77 18.89,34.77 20.95,32.7 20.95,31.43 21.62,30.77 R10.2
DATARX
  Top 0.305: 16F877A.26 66.04,36.2 66.67,36.83 69.22,36.83 69.85,36.2 69.85,33.34 67.54,31.03 48.5,31.03 42.89,25.42 33.97,25.42 31.04,28.35 R9.1
  Bottom 0.305: 16F877A.26 66.04,33.34 66.83,32.54 69.06,32.54 69.85,33.34 69.85,46.99 U2.D0
DATATX
  Top 0.305: 16F877A.25 68.56,34.74 68.56,33.02 67.13,31.59 48.24,31.59 42.68,26.04 34.43,26.04 29.7,30.77 R10.1
  Bottom 0.305: 16F877A.25 68.58,45.72 U2.D1
DTR
  Top 0.305: U4.2 9.76,38.65 10.64,39.53 18.73,39.53 21.27,36.99 21.27,33.97 21.91,33.34 C14.1
GATE_CMD
  Top 0.305: Q3.1 11.74,30.54 U9.1
GND  (via drill 0.35)
  other vias: 77.79,10.64 84.45,7.94 84.45,6.03 76.04,5.71 33.81,11.27 31.75,11.27 6.03,26.51 4.45,27.46 6.19,28.42 7.94,45.72 7.94,34.45 46.04,9.37 46.04,6.99 80.8,1.91 78.74,43.5 81.28,43.5 84.3,43.5 87,43.5 50.48,40.01 52.86,40.01 72.55,26.19 74.93,26.19 27.3,19.21 27.3,21.59 27.46,26.51
  pour Top (rank 2): 0,0 0,53.34 96.52,53.34 96.52,0
  pour Bottom (rank 2): 96.52,53.34 96.52,0 -0.16,0 -0.16,53.34
MCLR  (via drill 0.35)
  Top 0.305: v34.61,29.21 RN2.5 35.79,27.78 36.58,26.99 41.91,26.99 v43.18,28.26
  Bottom 0.305: 16F877A.1 30.48,28.1 31.59,29.21 v34.61,29.21 | v43.18,28.26 39.37,32.07 39.37,37.85 J4.1
OSC1
  Top 0.305: Q2.1 59.68,25.14 C2.1 59.05,23.18 59.37,22.86 R2.1 61.22,22.54 61.22,19.79 16F877A.13
OSC2
  Top 0.305: Q2.3 63.56,26.29 65.33,24.52 C3.1 65.72,23.5 65.09,22.86 R2.2 63.5,22.6 16F877A.14
PGC
  Top 0.305: 33.02,33.18 32.07,32.23 29.84,32.23 29.21,32.86 29.21,42.39 33.81,46.99 36.16,46.99 37.59,45.56 J4.4 | RN2.3 36.59,31.36 35.88,32.07 34.13,32.07 33.02,33.18 | 33.02,33.18 16F877A.39
PGD
  Top 0.305: 16F877A.40 30.48,36.35 | 30.48,36.35 30.48,41.72 33.47,44.7 J4.2 | RN2.2 37.39,31.83 36.51,32.7 34.77,32.7 34.13,33.34 34.13,36.51 33.66,36.99 31.11,36.99 30.48,36.35
PGM
  Top 0.305: RN2.1 39.68,30.47 40.64,31.43 16F877A.36 40.64,37.31 43.34,40.01 43.34,43.34 41.97,44.7 J4.6
PWRIN
  Top 1.27: J8.PWR 12.6,13.51 13.34,13.51 D2.A
PWRLED
  Top 0.305: R7.1 22.81,16.61 PWR.A
RE0  (via drill 0.35)
  Top 0.305: RN1.2 50.72,22.46 48.26,20 16F877A.8 | v65.09,8.1 65.18,8.19 S4.2 S4.1
  Bottom 0.305: v65.09,8.1 57.78,8.1 48.26,17.62 16F877A.8
RE1  (via drill 0.35)
  Top 0.305: RN1.3 51.52,21.99 50.8,21.27 16F877A.9 | v65.09,10.95 74.45,10.95 77.22,8.19 77.22,8.2 S2.2 S2.1
  Bottom 0.305: v65.09,10.95 56.52,10.95 50.8,16.67 16F877A.9
RE2  (via drill 0.35)
  Top 0.305: RN1.4 52.32,21.98 53.34,20.95 16F877A.10 | v65.09,12.22 82.8,12.22 S1.2 S1.1
  Bottom 0.305: v65.09,12.22 56.83,12.22 53.34,15.72 16F877A.10
RESET  (via drill 0.35)
  Top 0.305: S3.1 S3.2 v15.24,51.44 | RN2.4 v34.61,30.48 33.5,31.59 29.53,31.59 28.42,32.7 v26.35,32.7 | U2.RESET 35.56,16.35 34.13,17.78 34.13,22.54 35.72,24.13 v39.05,24.13 49.11,24.13 RN1.1
  Bottom 0.305: v39.05,24.13 36.99,24.13 35.72,25.4 35.72,29.53 34.77,30.48 v34.61,30.48 | v15.24,51.44 11.27,51.44 9.68,49.85 9.68,44.45 10.64,43.5 22.23,43.5 24.13,41.59 24.13,34.13 24.29,33.97 v26.35,33.97
  pour Bottom: 23.97,34.61 23.97,32.07 27.15,32.07 27.15,34.61
  pour Top: 23.97,32.07 27.15,32.07 27.15,34.61 23.97,34.61
RX1
  Top 0.305: RX1.C 24.67,37.17 R8.2
RXLED  (via drill 0.35)
  Top 0.305: v13.65,45.4 13.01,44.76 U4.22 | v18.04,46.02 20.48,43.59 20.48,39.37 22.48,37.37 R8.1
  Bottom 0.305: v13.65,45.4 14.29,46.04 18.04,46.04 v18.04,46.02
TX1
  Top 0.305: TX1.C 24.67,41.2 R4.2
TXLED  (via drill 0.35)
  Top 0.305: v11.75,45.4 12.36,44.79 U4.23 | v19.95,46.81 21.75,45.01 21.75,42.55 22.89,41.4 R4.1
  Bottom 0.305: v19.95,46.81 19.93,46.83 13.18,46.83 v11.75,45.4
USB_N
  Top 0.203: U4.16 16.91,43.11 16.03,42.23 J3.2
USB_P
  Top 0.203: U4.15 17.56,43.11 16.13,41.69 4.99,41.69 J3.3
V5VUSB  (via drill 0.35)
  Top 0.305: Q3.3 4.99,31.24 4.99,29.88 v4.32,29.21 | FUSE.2 2.22,35.24 v2.03,35.05
  Bottom 0.305: v2.03,35.05 2.03,30.23 3.05,29.21 v4.32,29.21
VCC_2  (via drill 0.35)
  Top 0.305: U1.5 | v18.73,24.29 18.73,23.14 U1.5 | v13.34,29.21 U9.2 | C1.1 21.8,22.86 U1.5
  Top 0.813: J5.2 J5.1 38.1,8.9 U2.3V
  Bottom 0.305: v18.73,24.29 14.13,24.29 13.34,25.08 v13.34,29.21
  Bottom 0.813: J5.2 35.74,13.97 23.65,13.97 19.68,17.94 19.68,23.97 v20,24.29
  pour Top: 17.94,21.91 20.95,21.91 20.95,25.24 18.26,25.24 17.62,24.61 17.62,22.23
  pour Bottom: 20.95,21.91 20.95,25.24 18.26,25.24 17.62,24.61 17.62,22.23 17.94,21.91
VDD  (via drill 0.35)
  Top 0.305: RN1.8 49.9,26.2 49.9,27.2 50.48,27.78 52.65,27.78 53.5,26.93 53.5,25.24 54.19,24.55 C12.1 | S2.4 S2.3 | S1.4 S1.3 88.55,2.6 87.11,1.17 83.03,1.17 82.23,1.96 S2.3 | S2.3 81.97,2.87 80.44,2.87 78.74,1.17 75.25,1.17 73.82,2.6 S4.3 S4.4 72.48,9.53 59.21,9.53 55.88,12.86 55.88,17.62 | U4.20 14.31,44.79 16.35,46.83 18.57,46.83 21.19,44.22 21.19,40.25 v22.07,39.37 22.08,39.39 TX1.A | v22.07,35.4 22.11,35.35 RX1.A | U4.4 11.06,38.21 v11.11,38.26 | R7.2 24.71,11.17 v24.77,11.11
  Top 0.508: U1.3 16.67,20.96 17.14,21.43 17.14,22.23 16.51,22.86 U1.1 15.85,26.54 14.76,27.62 14.76,31.43 13.88,32.32 Q3.2 | 16F877A.11 C12.1
  Top 0.813: U2.5V 40.64,8.9 J5.3 J5.4 40.49,14.7 42.3,16.51 54.77,16.51 55.88,17.62 56.04,17.78 56.04,19.37 16F877A.11
  Bottom 0.305: v22.07,35.4 v22.07,39.37 13.65,39.37 v12.54,38.26
  Bottom 0.508: 16F877A.11 55.88,23.5 50.8,28.57 16F877A.32 50.8,37.15 48.1,39.85 38.82,39.85 37.59,41.07 J4.3 | v11.11,38.26 11.27,38.1 v11.27,32.38
  Bottom 0.813: J5.3 40.49,8.39 38.77,6.67 32.86,6.67 29.53,10 v26.67,10
  Bottom 1.016: v22.86,11.11 14.61,19.37 v2.22,19.37
  other vias: 22.86,10 26.67,11.11 2.22,21.11 2.22,22.86 2.22,24.45 9.84,32.38
  pour Top: 8.73,20.48 13.18,20.48 13.18,22.7 8.73,22.7 8.73,24.92 3.33,24.92 3.33,31.27 16.19,31.27 16.19,29.84 18.73,29.84 18.73,33.18 0.79,33.18 0,32.38 0,18.26 8.73,18.26
  pour Top: 27.78,12.7 21.91,12.7 21.91,6.67 22.38,6.19 27.3,6.19 27.78,6.67
  pour Bottom: 0,18.26 9.68,18.26 9.68,24.77 9.68,24.92 3.33,24.92 3.33,26.83 0,26.83
  pour Bottom: 27.3,6.19 22.54,6.19 22.38,6.19 21.91,6.67 21.91,12.7 27.78,12.7 27.78,6.67
  pour Top: 10.48,37.47 13.81,37.47 13.81,39.21 10.79,39.21 10.16,38.58 10.16,37.47
  pour Bottom: 10.16,37.47 13.81,37.47 13.81,39.21 10.79,39.21 10.16,38.58
  pour Bottom: 8.57,31.27 12.7,31.27 12.7,33.18 8.57,33.18
  pour Top: 57.31,16.19 57.31,25.24 54.45,25.24 54.45,16.19
VDD5  (via drill 0.35)
  Top 0.305: J3.1 6.32,42.89 v6.86,43.43 | v6.35,35.31 6.29,35.24 FUSE.1
  Bottom 0.305: v6.86,43.43 6.86,35.81 v6.35,35.31
VIN  (via drill 0.35)
  Top 0.305: RN3.3 8.17,28.02 7.46,27.3 7.46,26.04 8.1,25.4 10.32,25.4 11.04,24.68 U8.3
  Top 0.813: U8.3 12.29,23.9 13.65,22.54 13.65,20.15 D2.C 18.59,17.61 19.68,16.51 19.68,9.21 18.59,8.12 C10.+
  Bottom 0.813: U2.VIN 48.26,3.33 46.83,4.76 22.07,4.76 20.32,6.51 v20.32,8.1
  other vias: 14.61,8.1 20.16,10.32 18.41,10.32 16.51,10.32 14.61,10.32
  pour Top: 21.27,5.4 13.34,5.4 13.34,11.11 21.27,11.11
  pour Bottom: 21.27,5.4 21.27,11.11 13.34,11.11 13.34,5.4

### Text on the board
tNames: HORMIGA 877 | RESET | Digital | ~ | ~ | TX | RX | ICSP | TX | RX | GPIO | 14 | 15 | 16 | 17 | 18 | 19 | 20 | 21 | D13 | 22 | 23 | PWR | 3V3 | 5VDC | GND | PB0 | PB1 | PB2 | GND | 3V3 | 5VDC | Analog | Power | 4 | D24
bNames: PGC | Rev_B / By MFF Desgin | PGD | PGM | MCLR | GND | VDD